# Altium project PCB.PrjPcb (part 1 of 2)
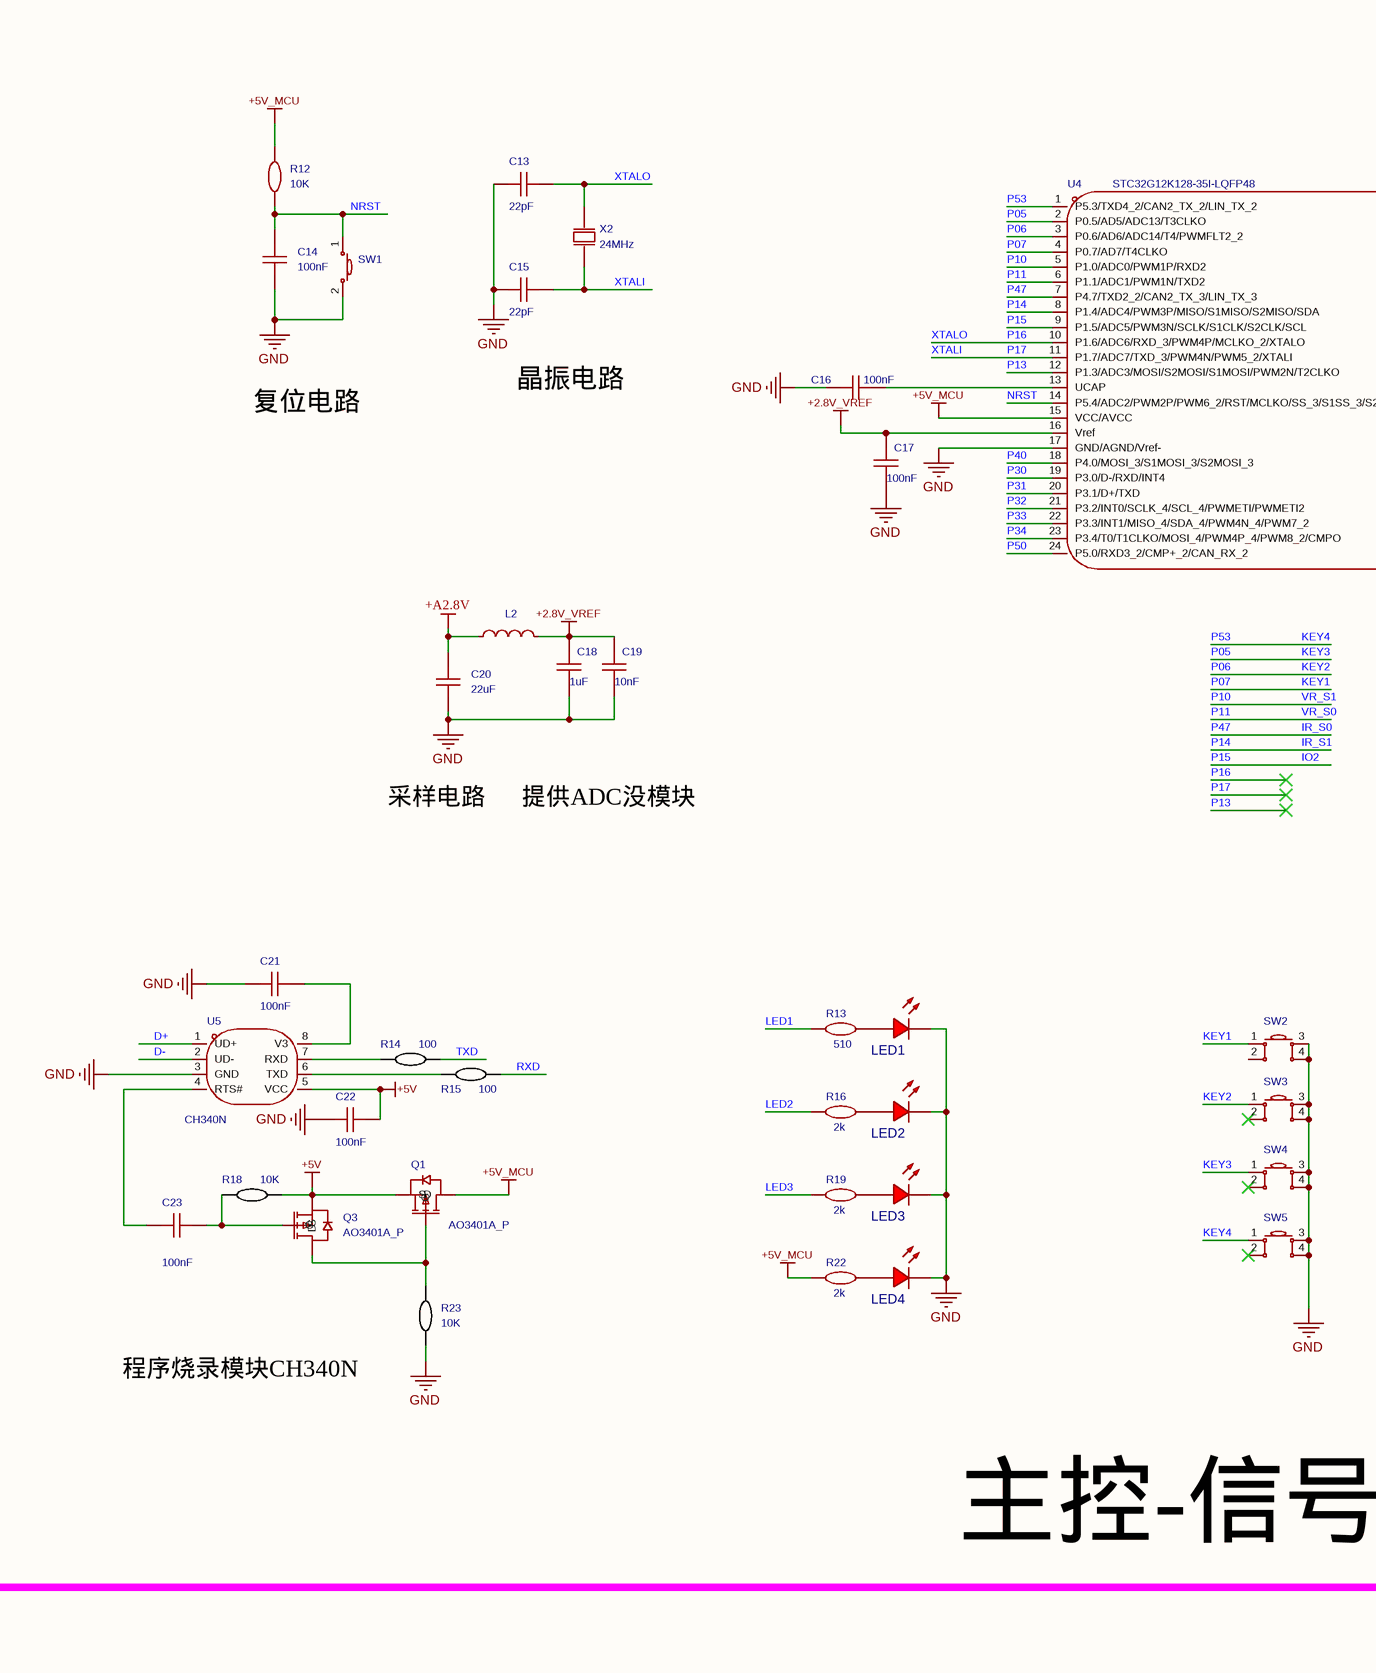
[diagram p0: Sheet1.SchDoc, row 1 of 4 left]
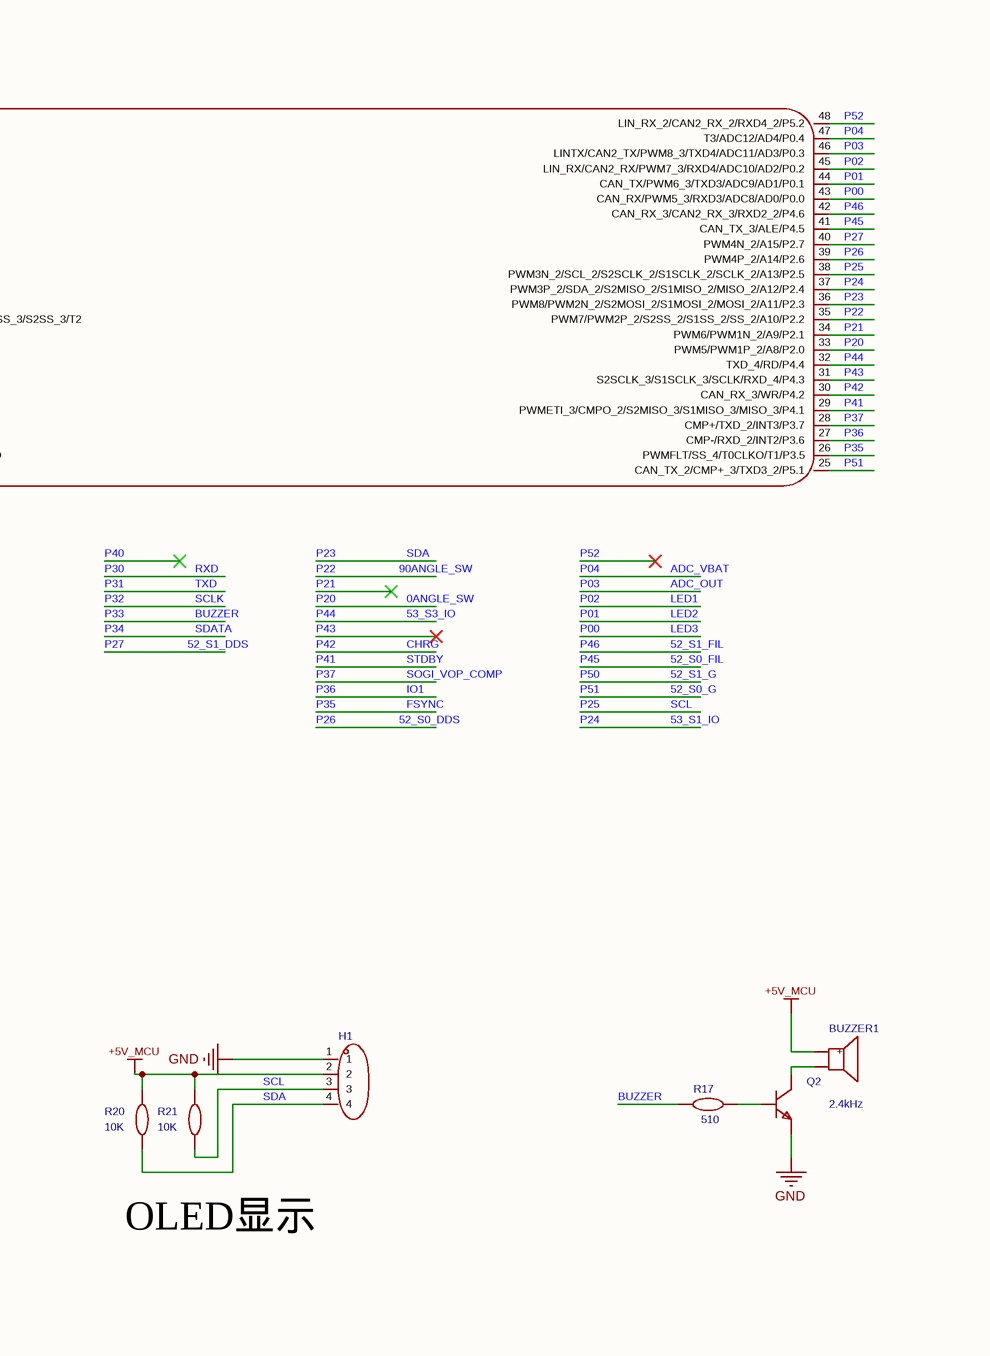
[diagram p1: Sheet1.SchDoc, row 1 of 4 right]
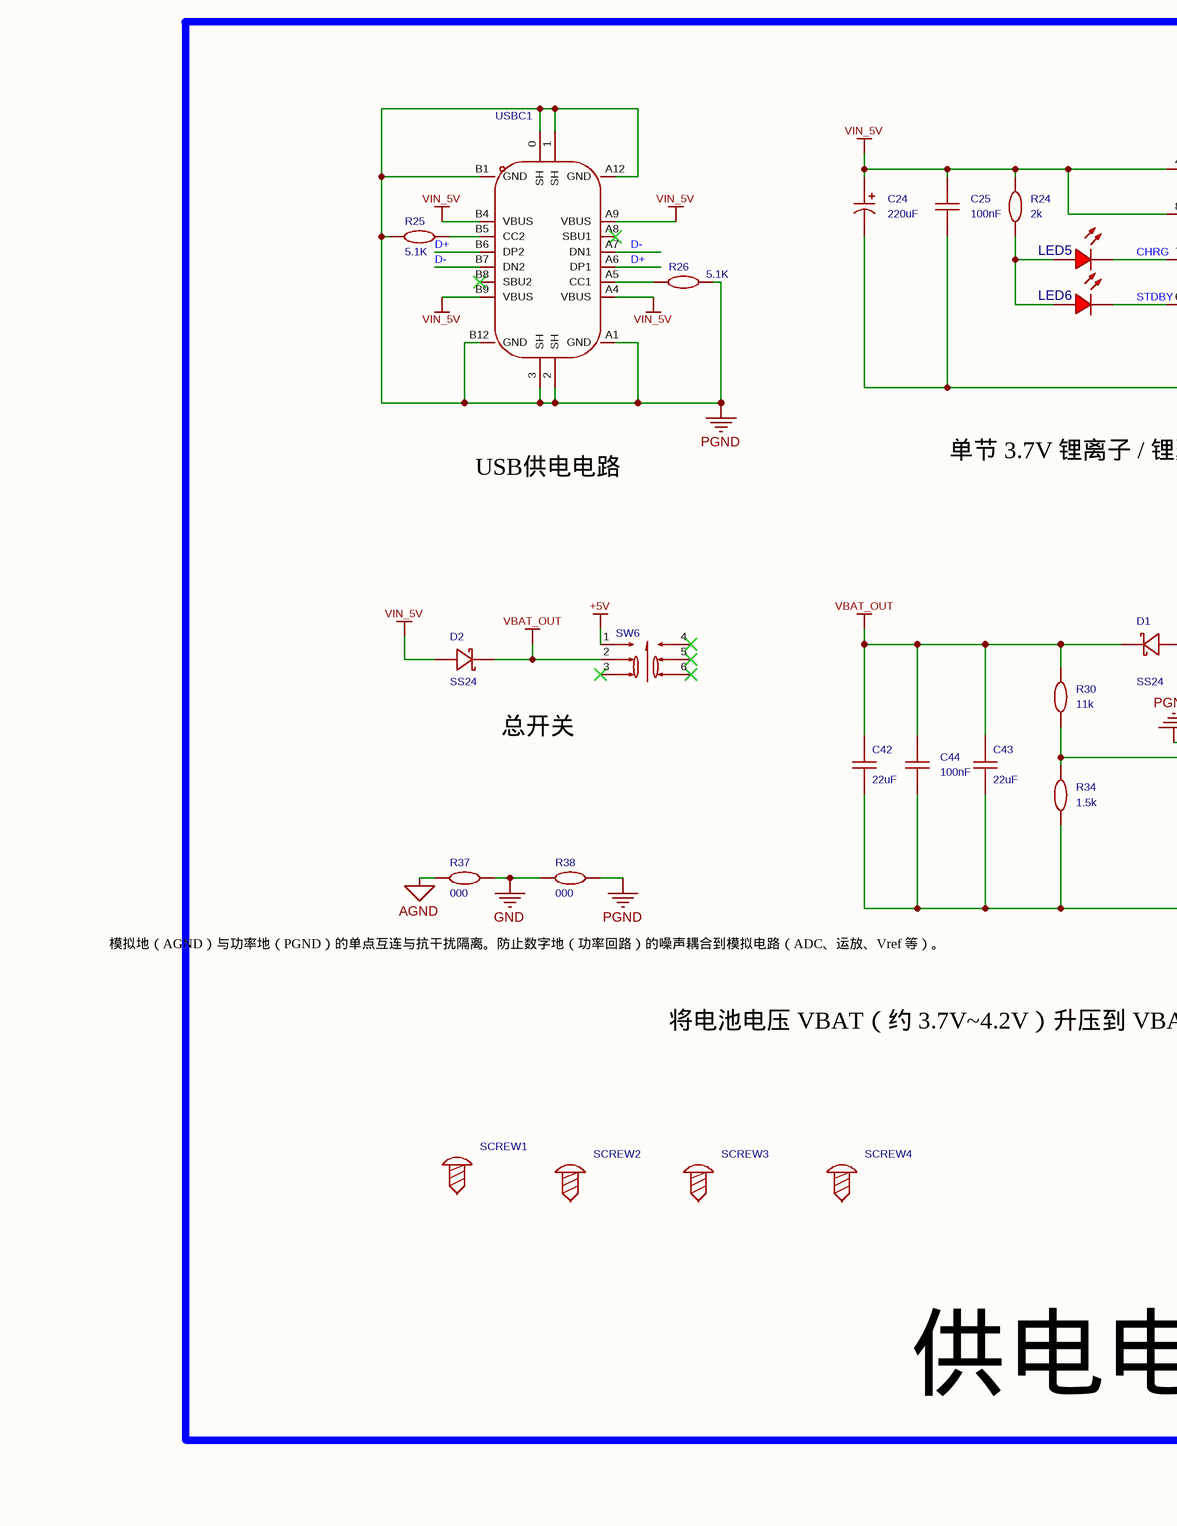
[diagram p2: Sheet1.SchDoc, row 2 of 4 left]
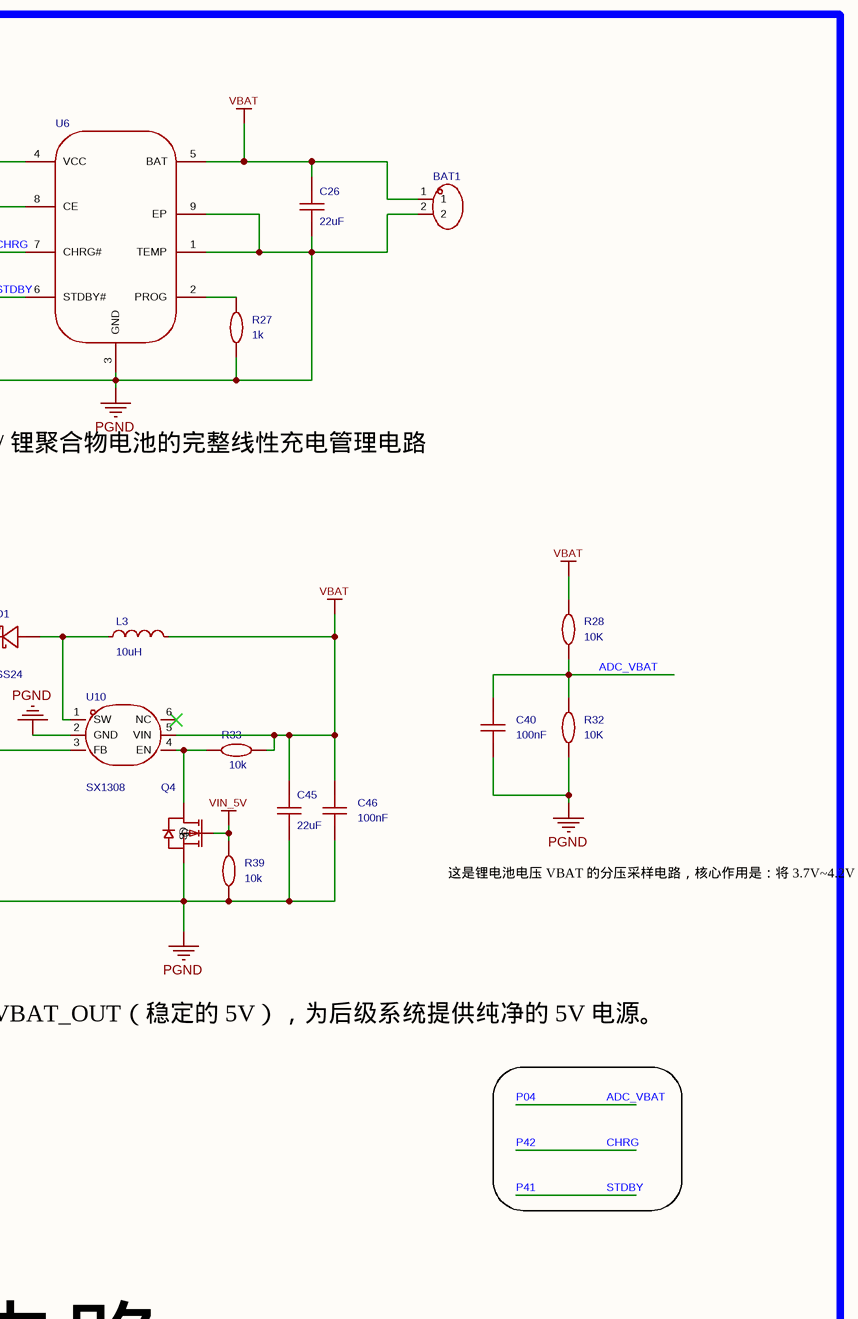
[diagram p3: Sheet1.SchDoc, row 2 of 4 right]
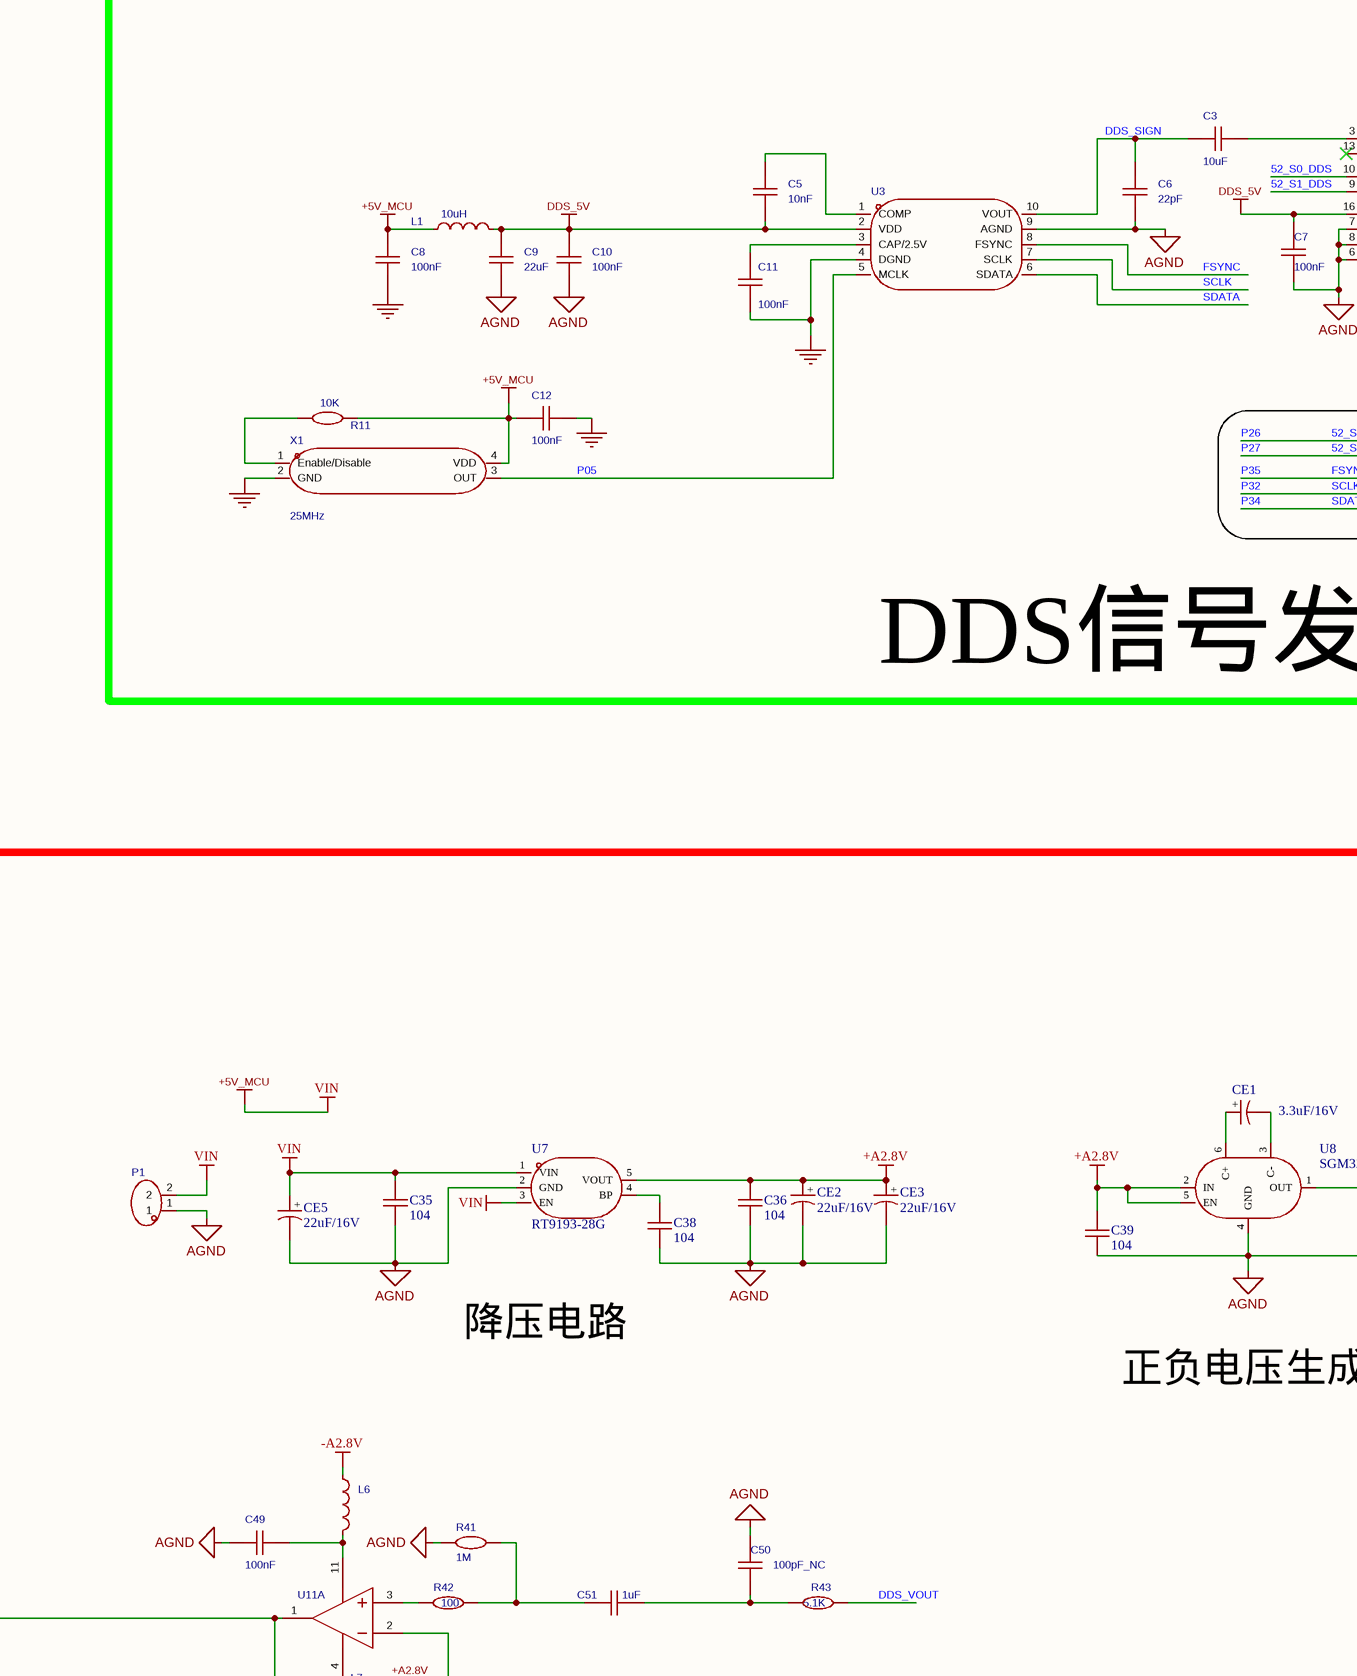
[diagram p4: Sheet1.SchDoc, row 3 of 4 left]
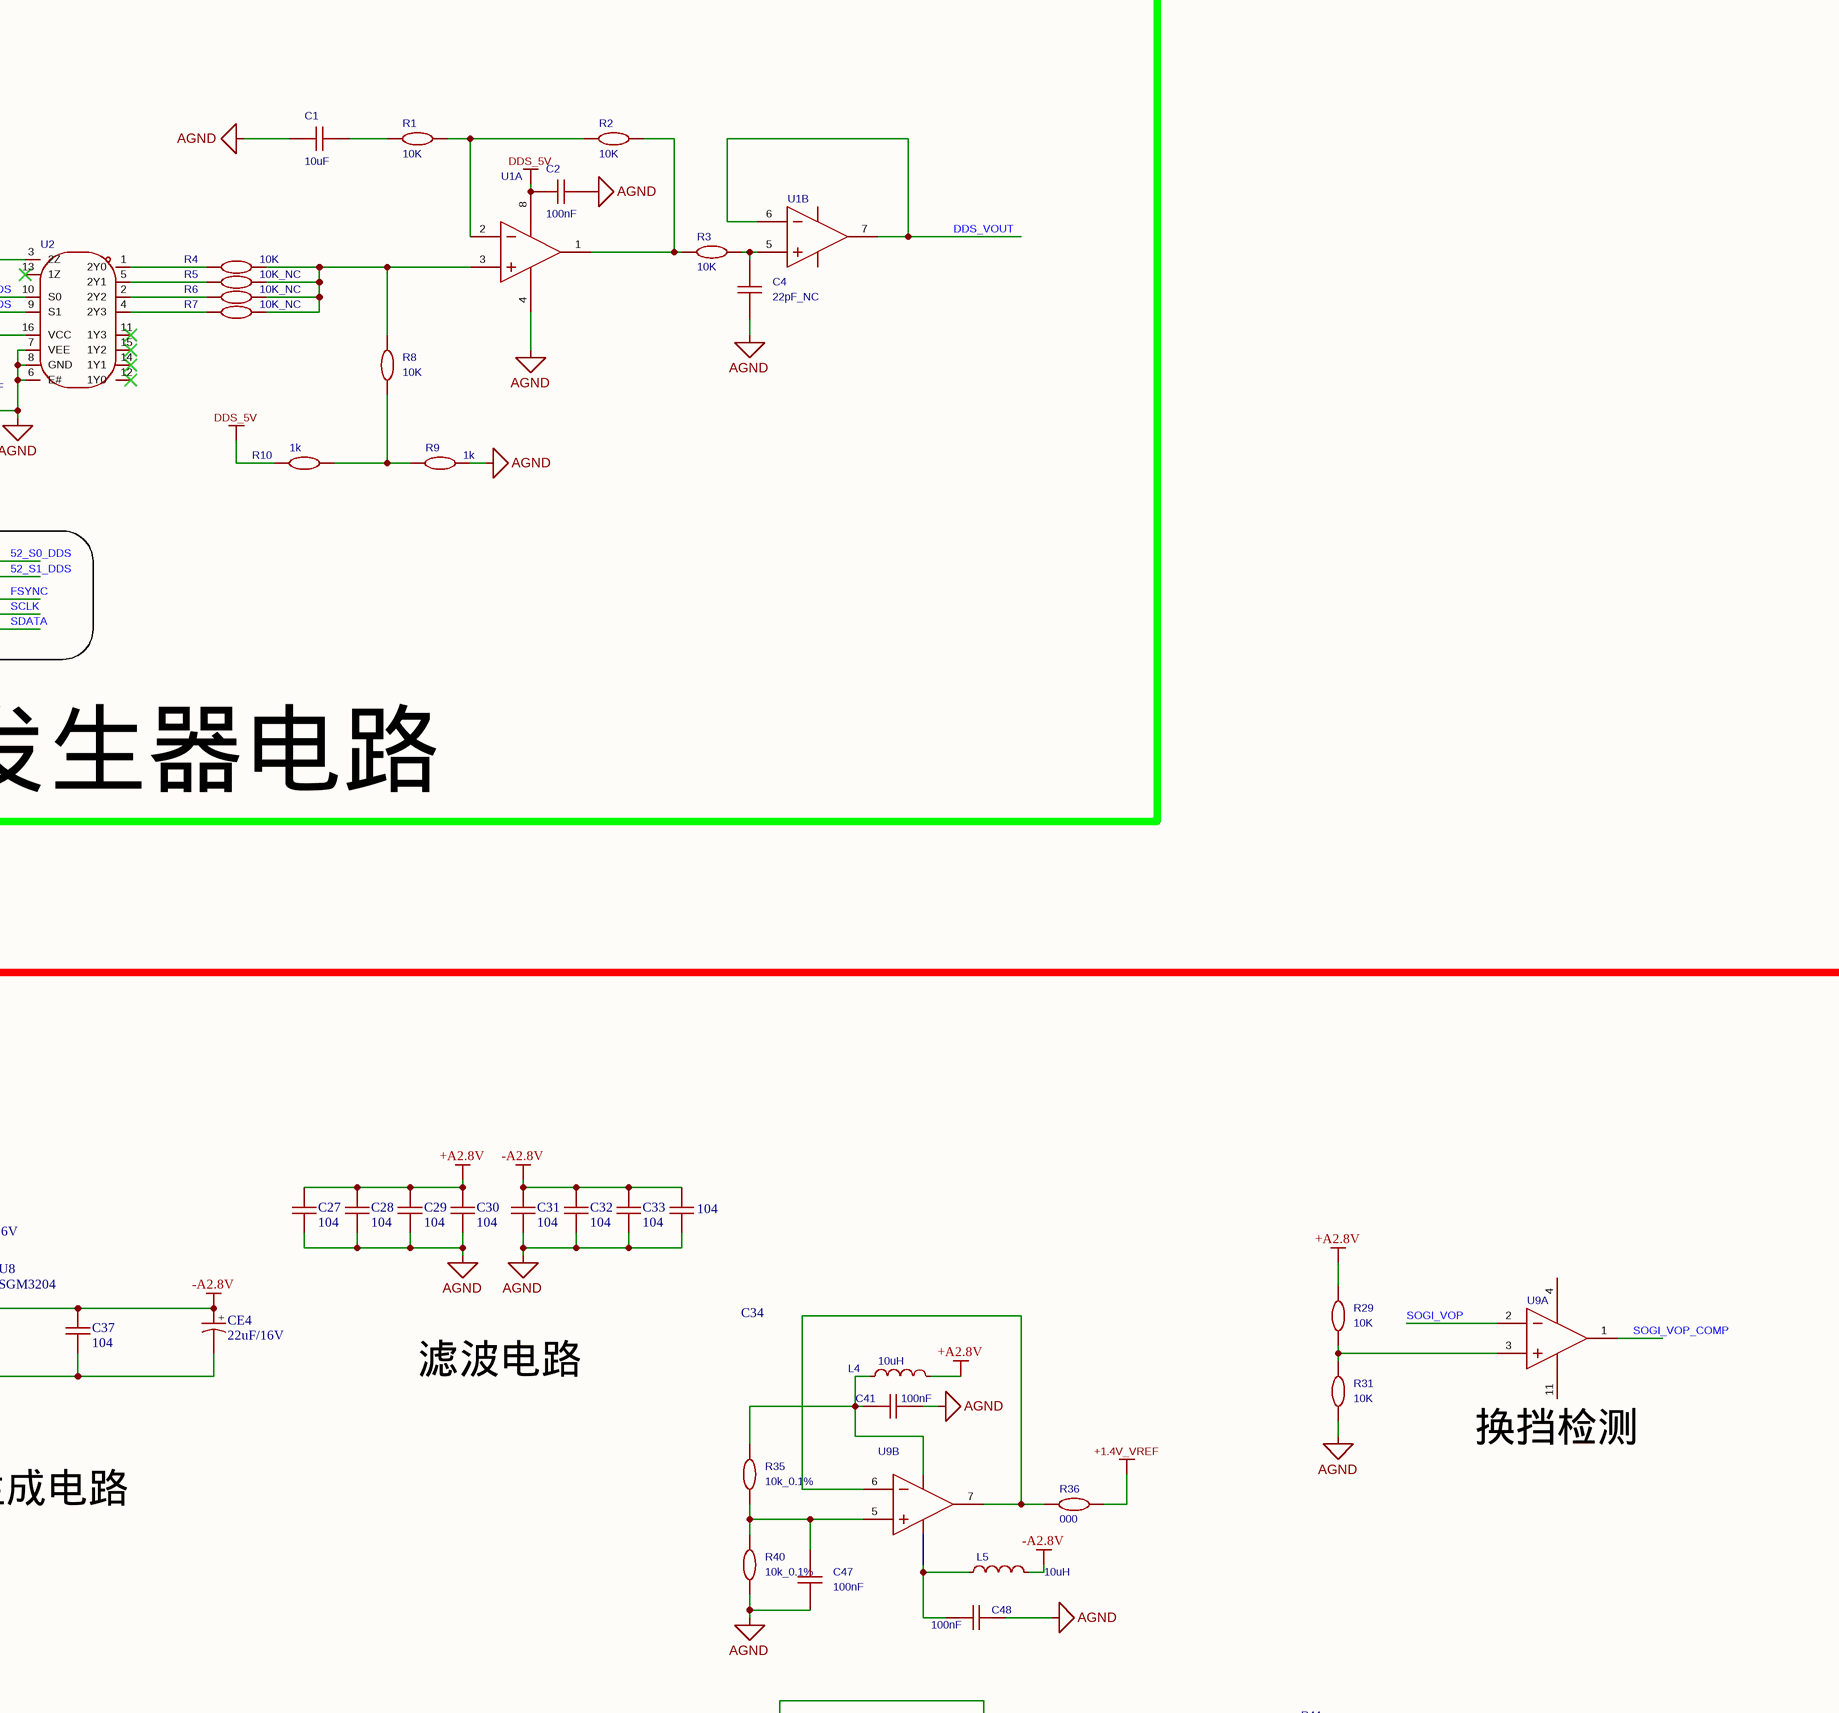
[diagram p5: Sheet1.SchDoc, row 3 of 4 right]
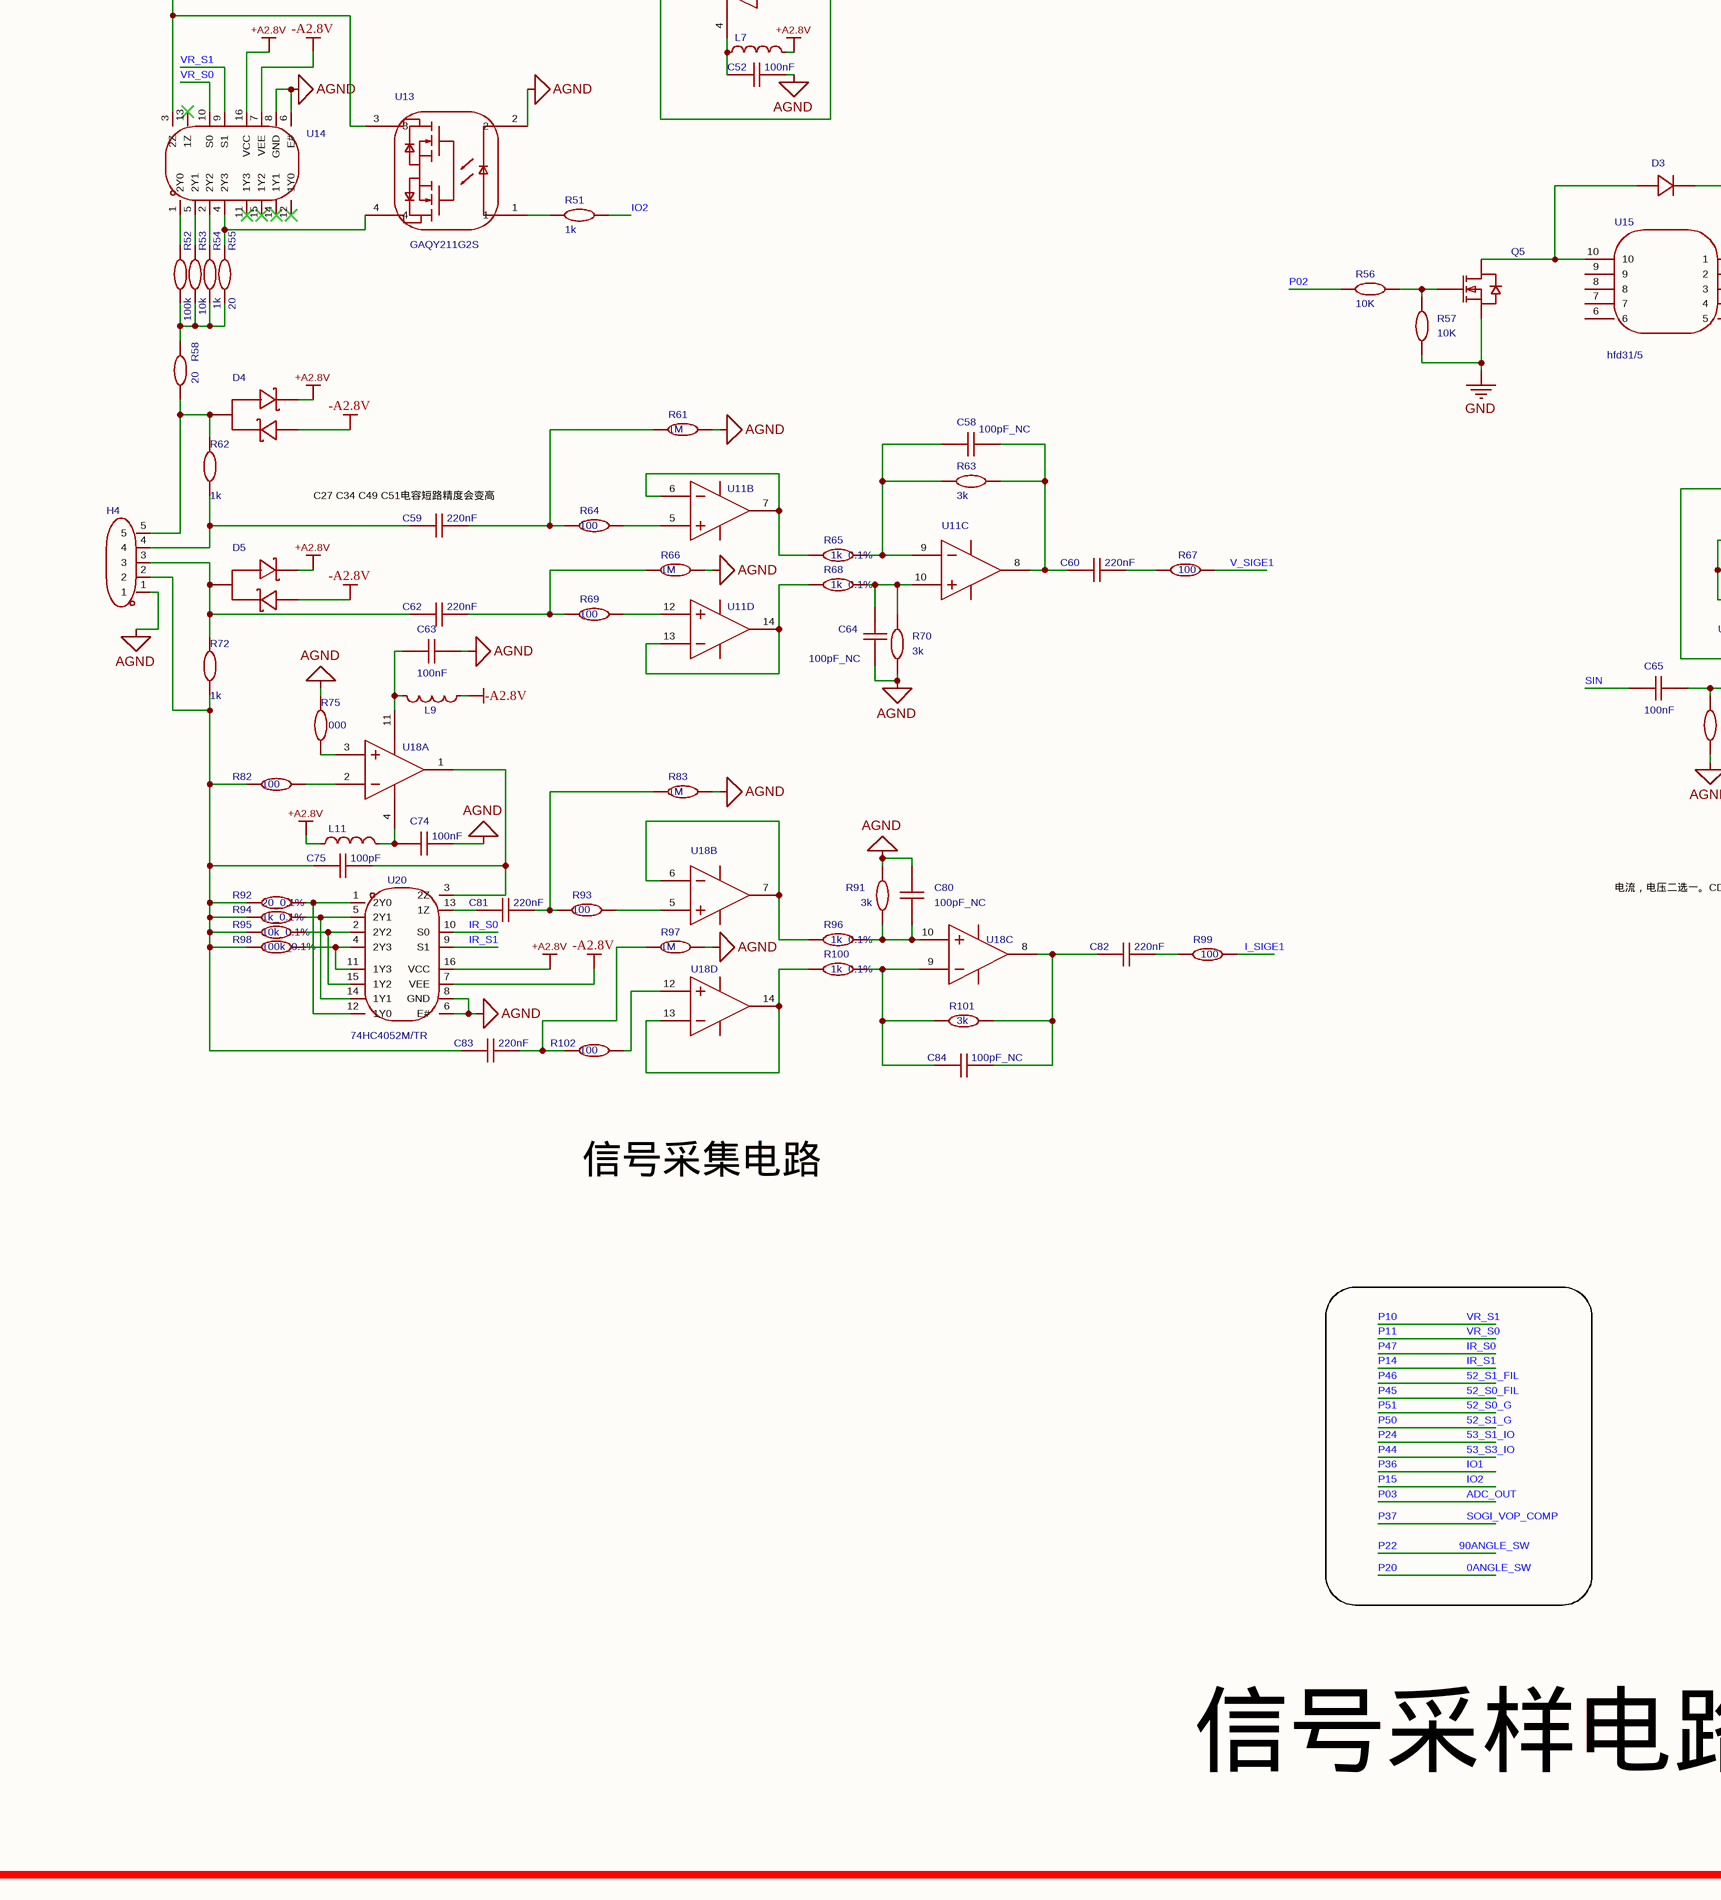
[diagram p6: Sheet1.SchDoc, row 4 of 4 left]
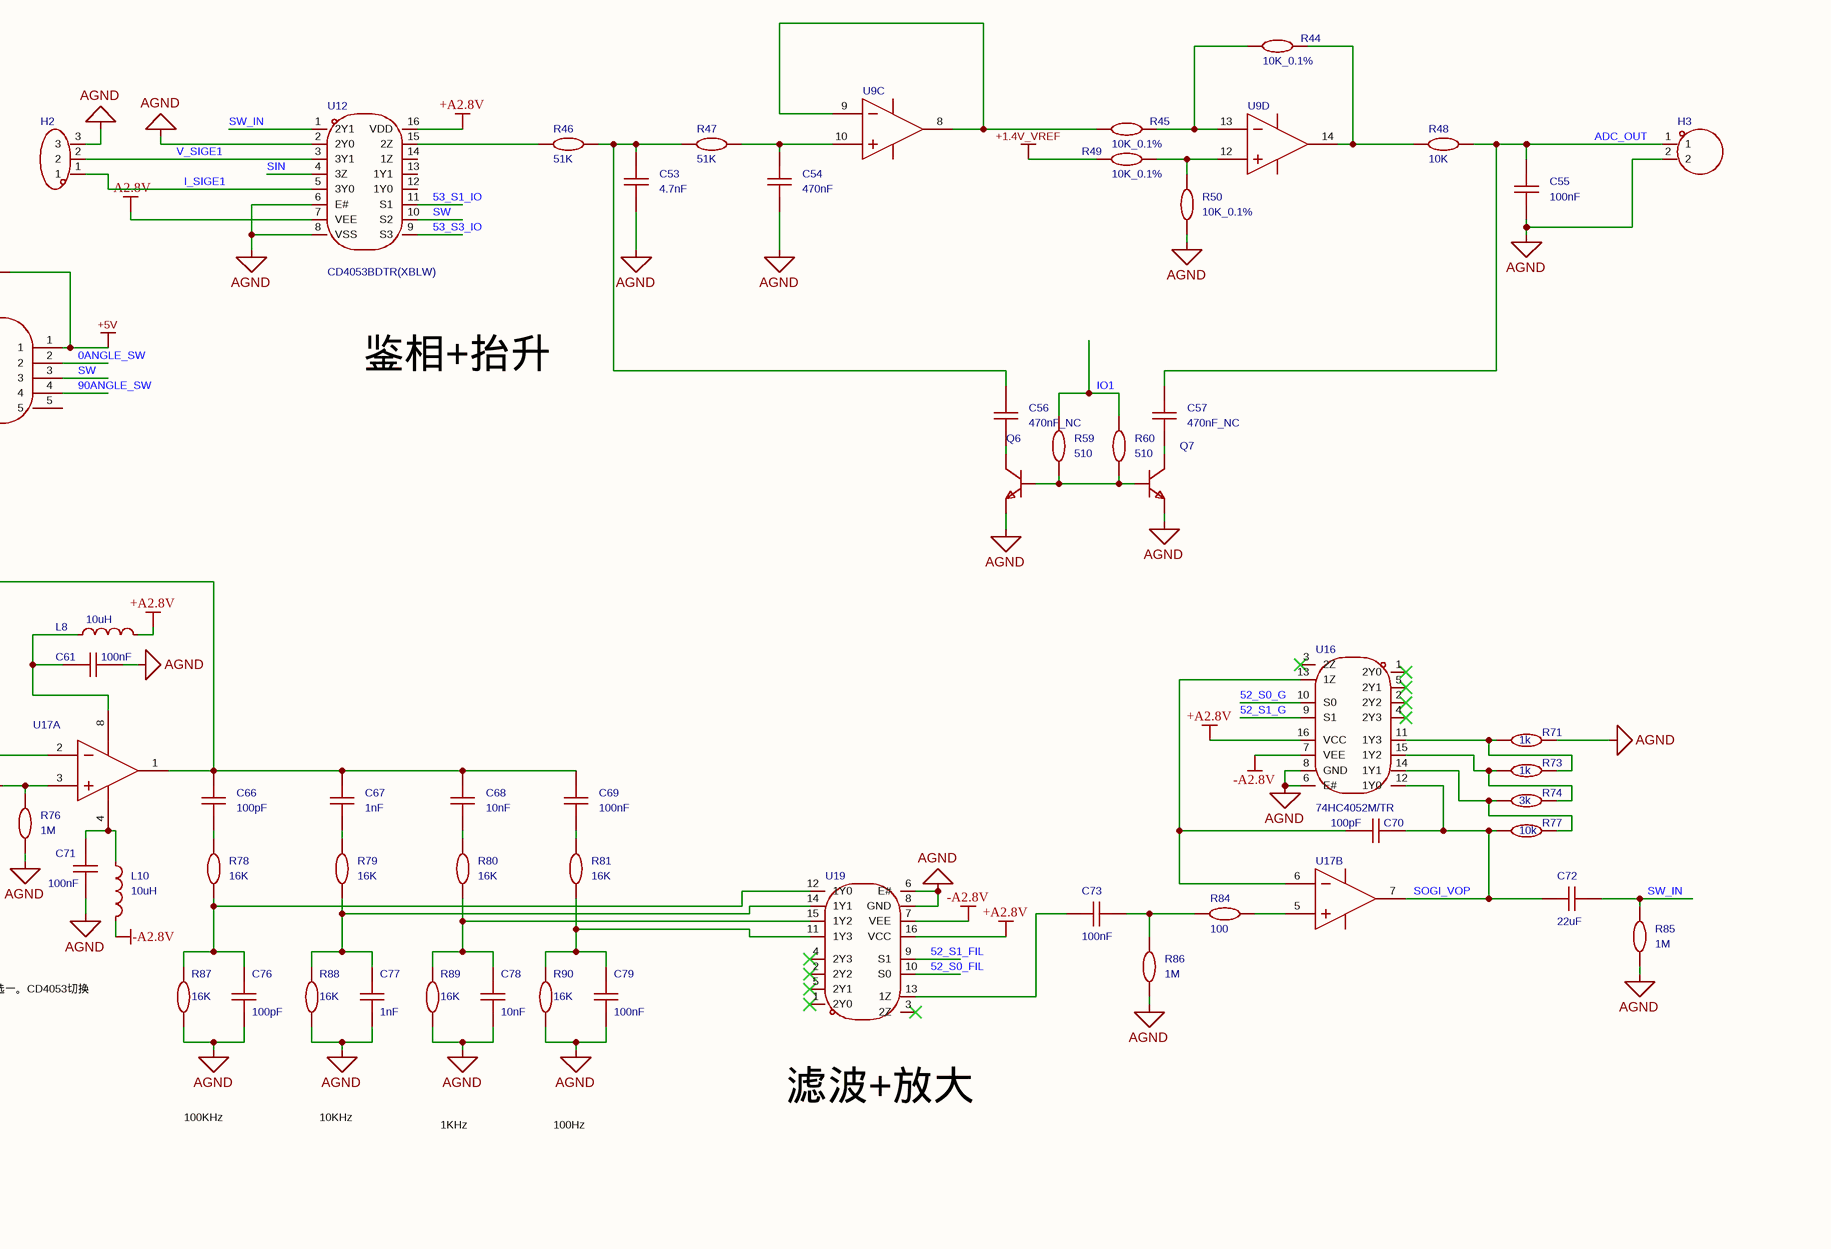
[diagram p7: Sheet1.SchDoc, row 4 of 4 right]
1 sheet, 260 parts. Net scope: global (net labels, ports and power ports of the same name join across sheets).
Board file: PCB1.PcbDoc